# EasyEDA schematic SCH_ESP32-HMI.json

## Sheets
1 Sheet_1: TITLE: ESP32-HMI; REV: 1.0; Date: 2022-04-22; Sheet: 1/1; Drawn By: Link-Stardust; Company: SoTWild
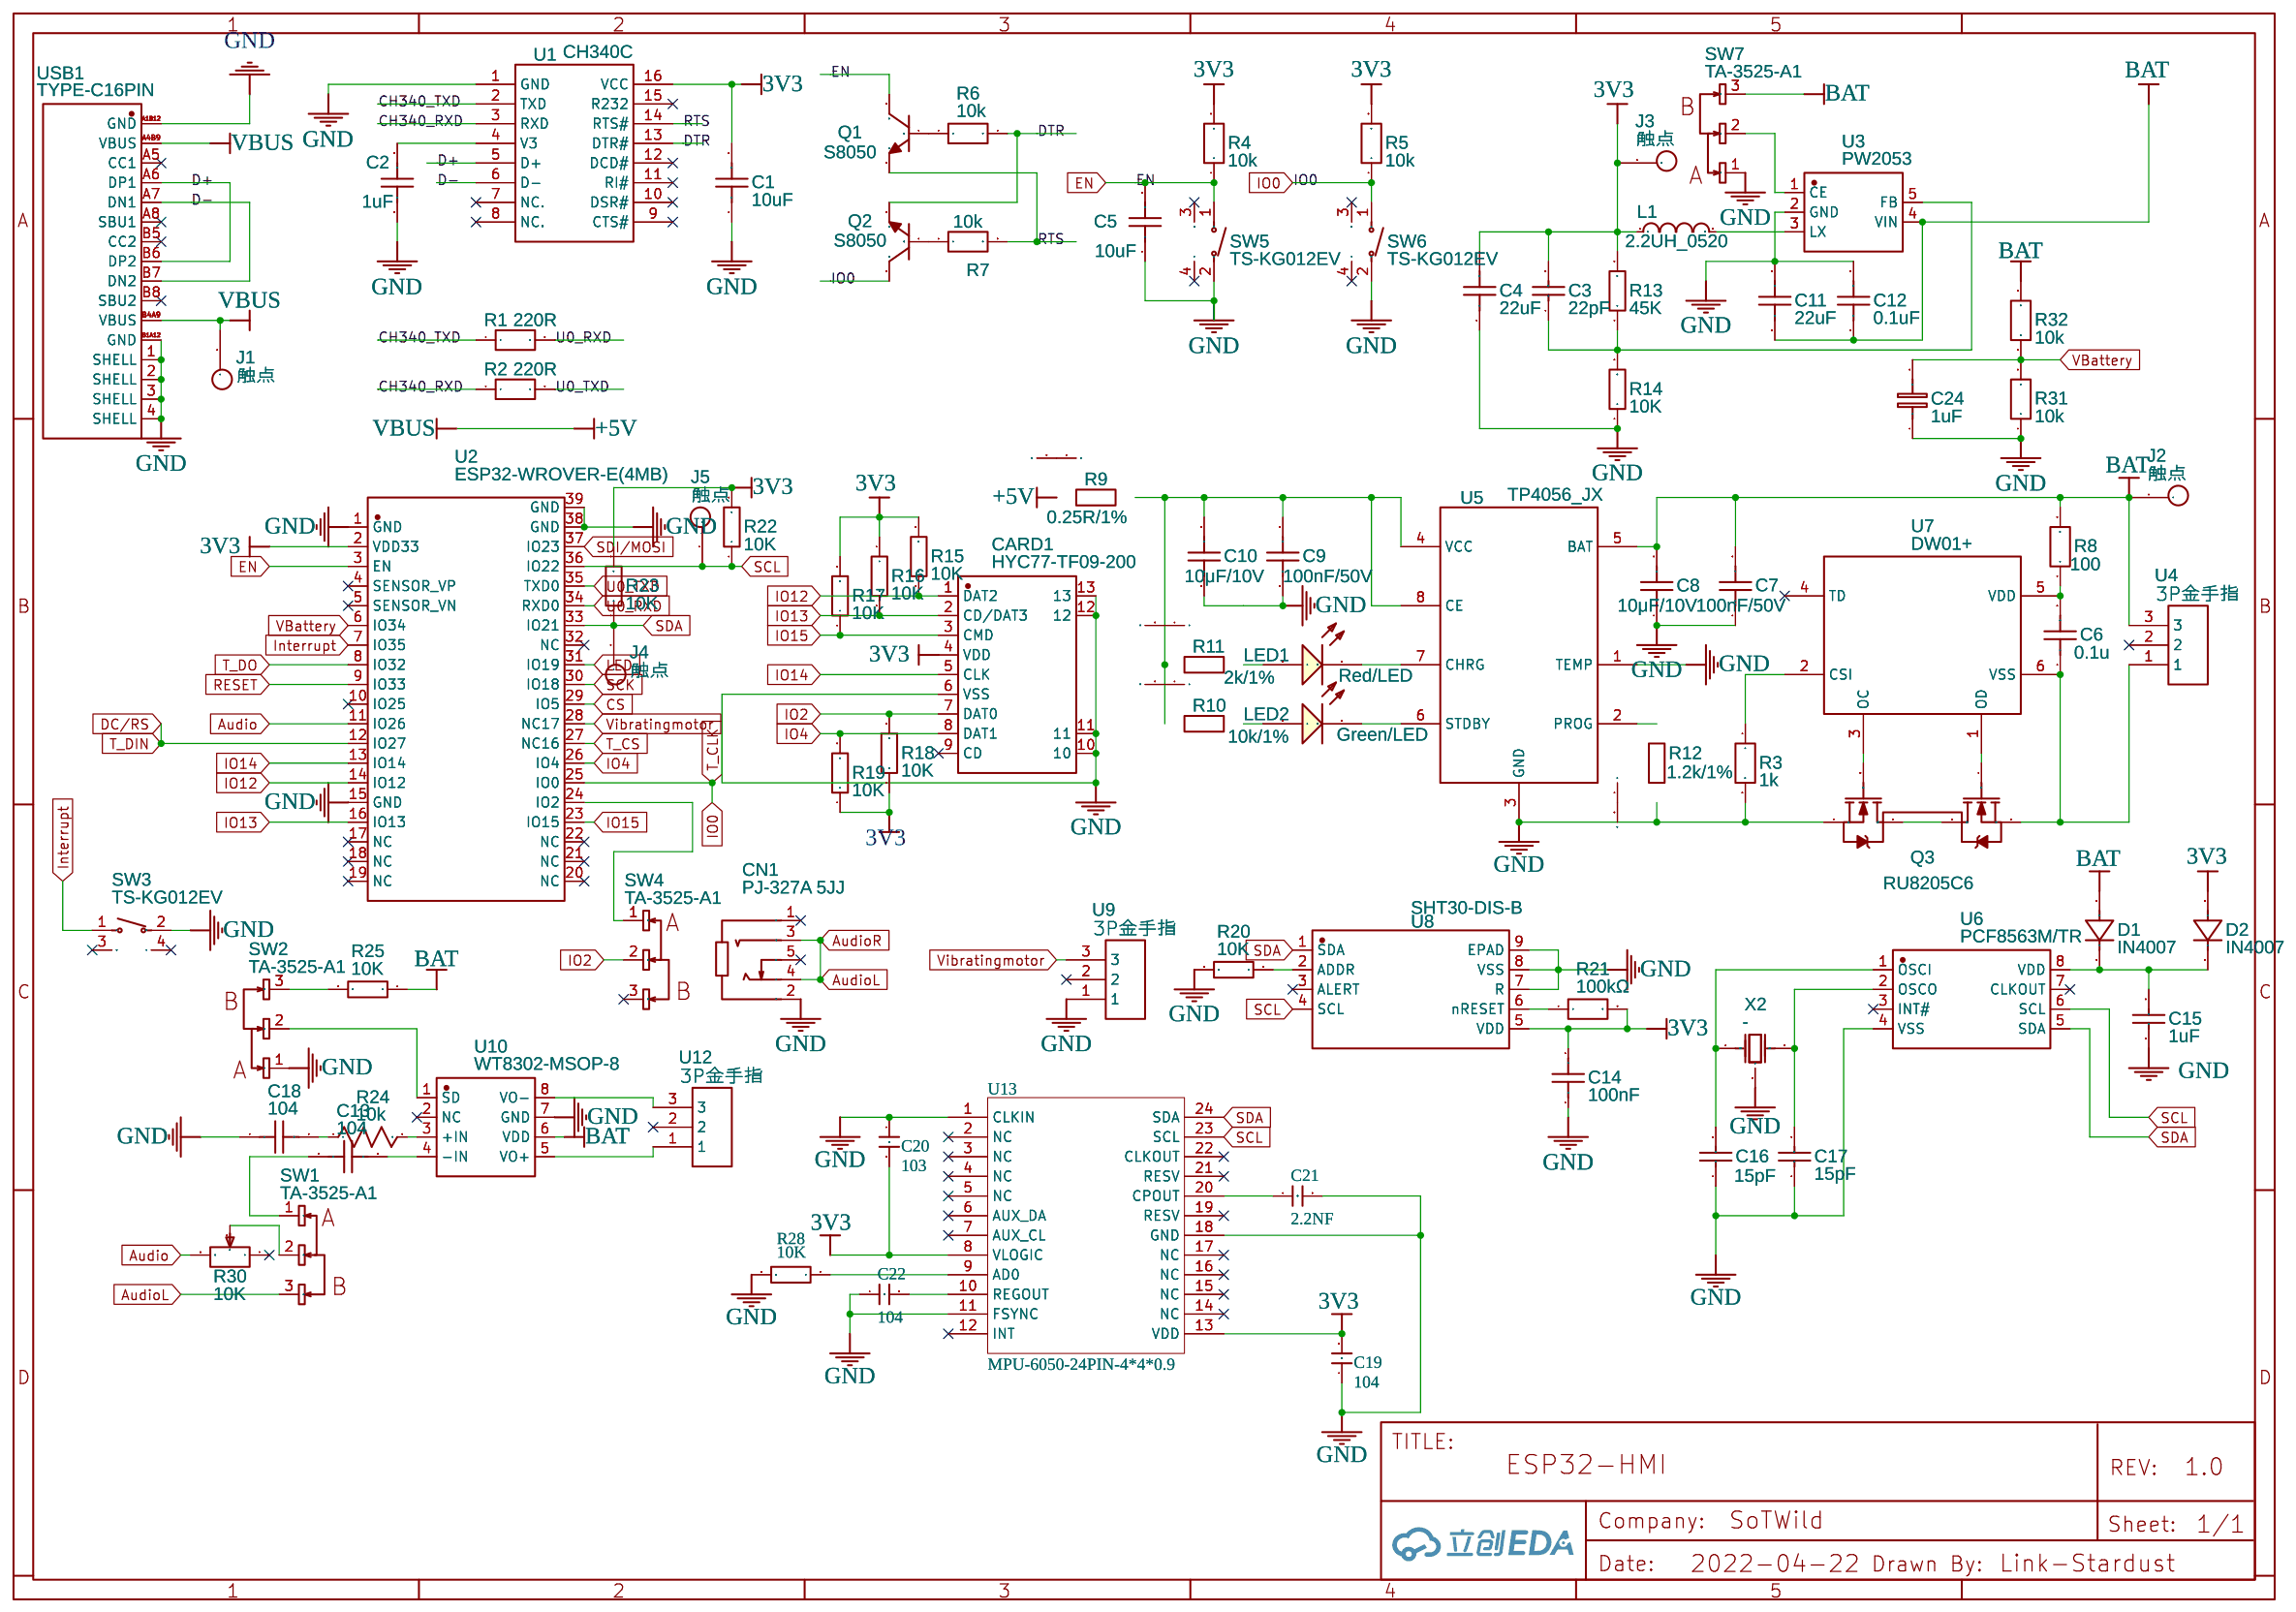
[diagram p0: Sheet_1]
2 Sheet_2: TITLE: Sheet_2; Date: 2022-07-26; Company: Your Company
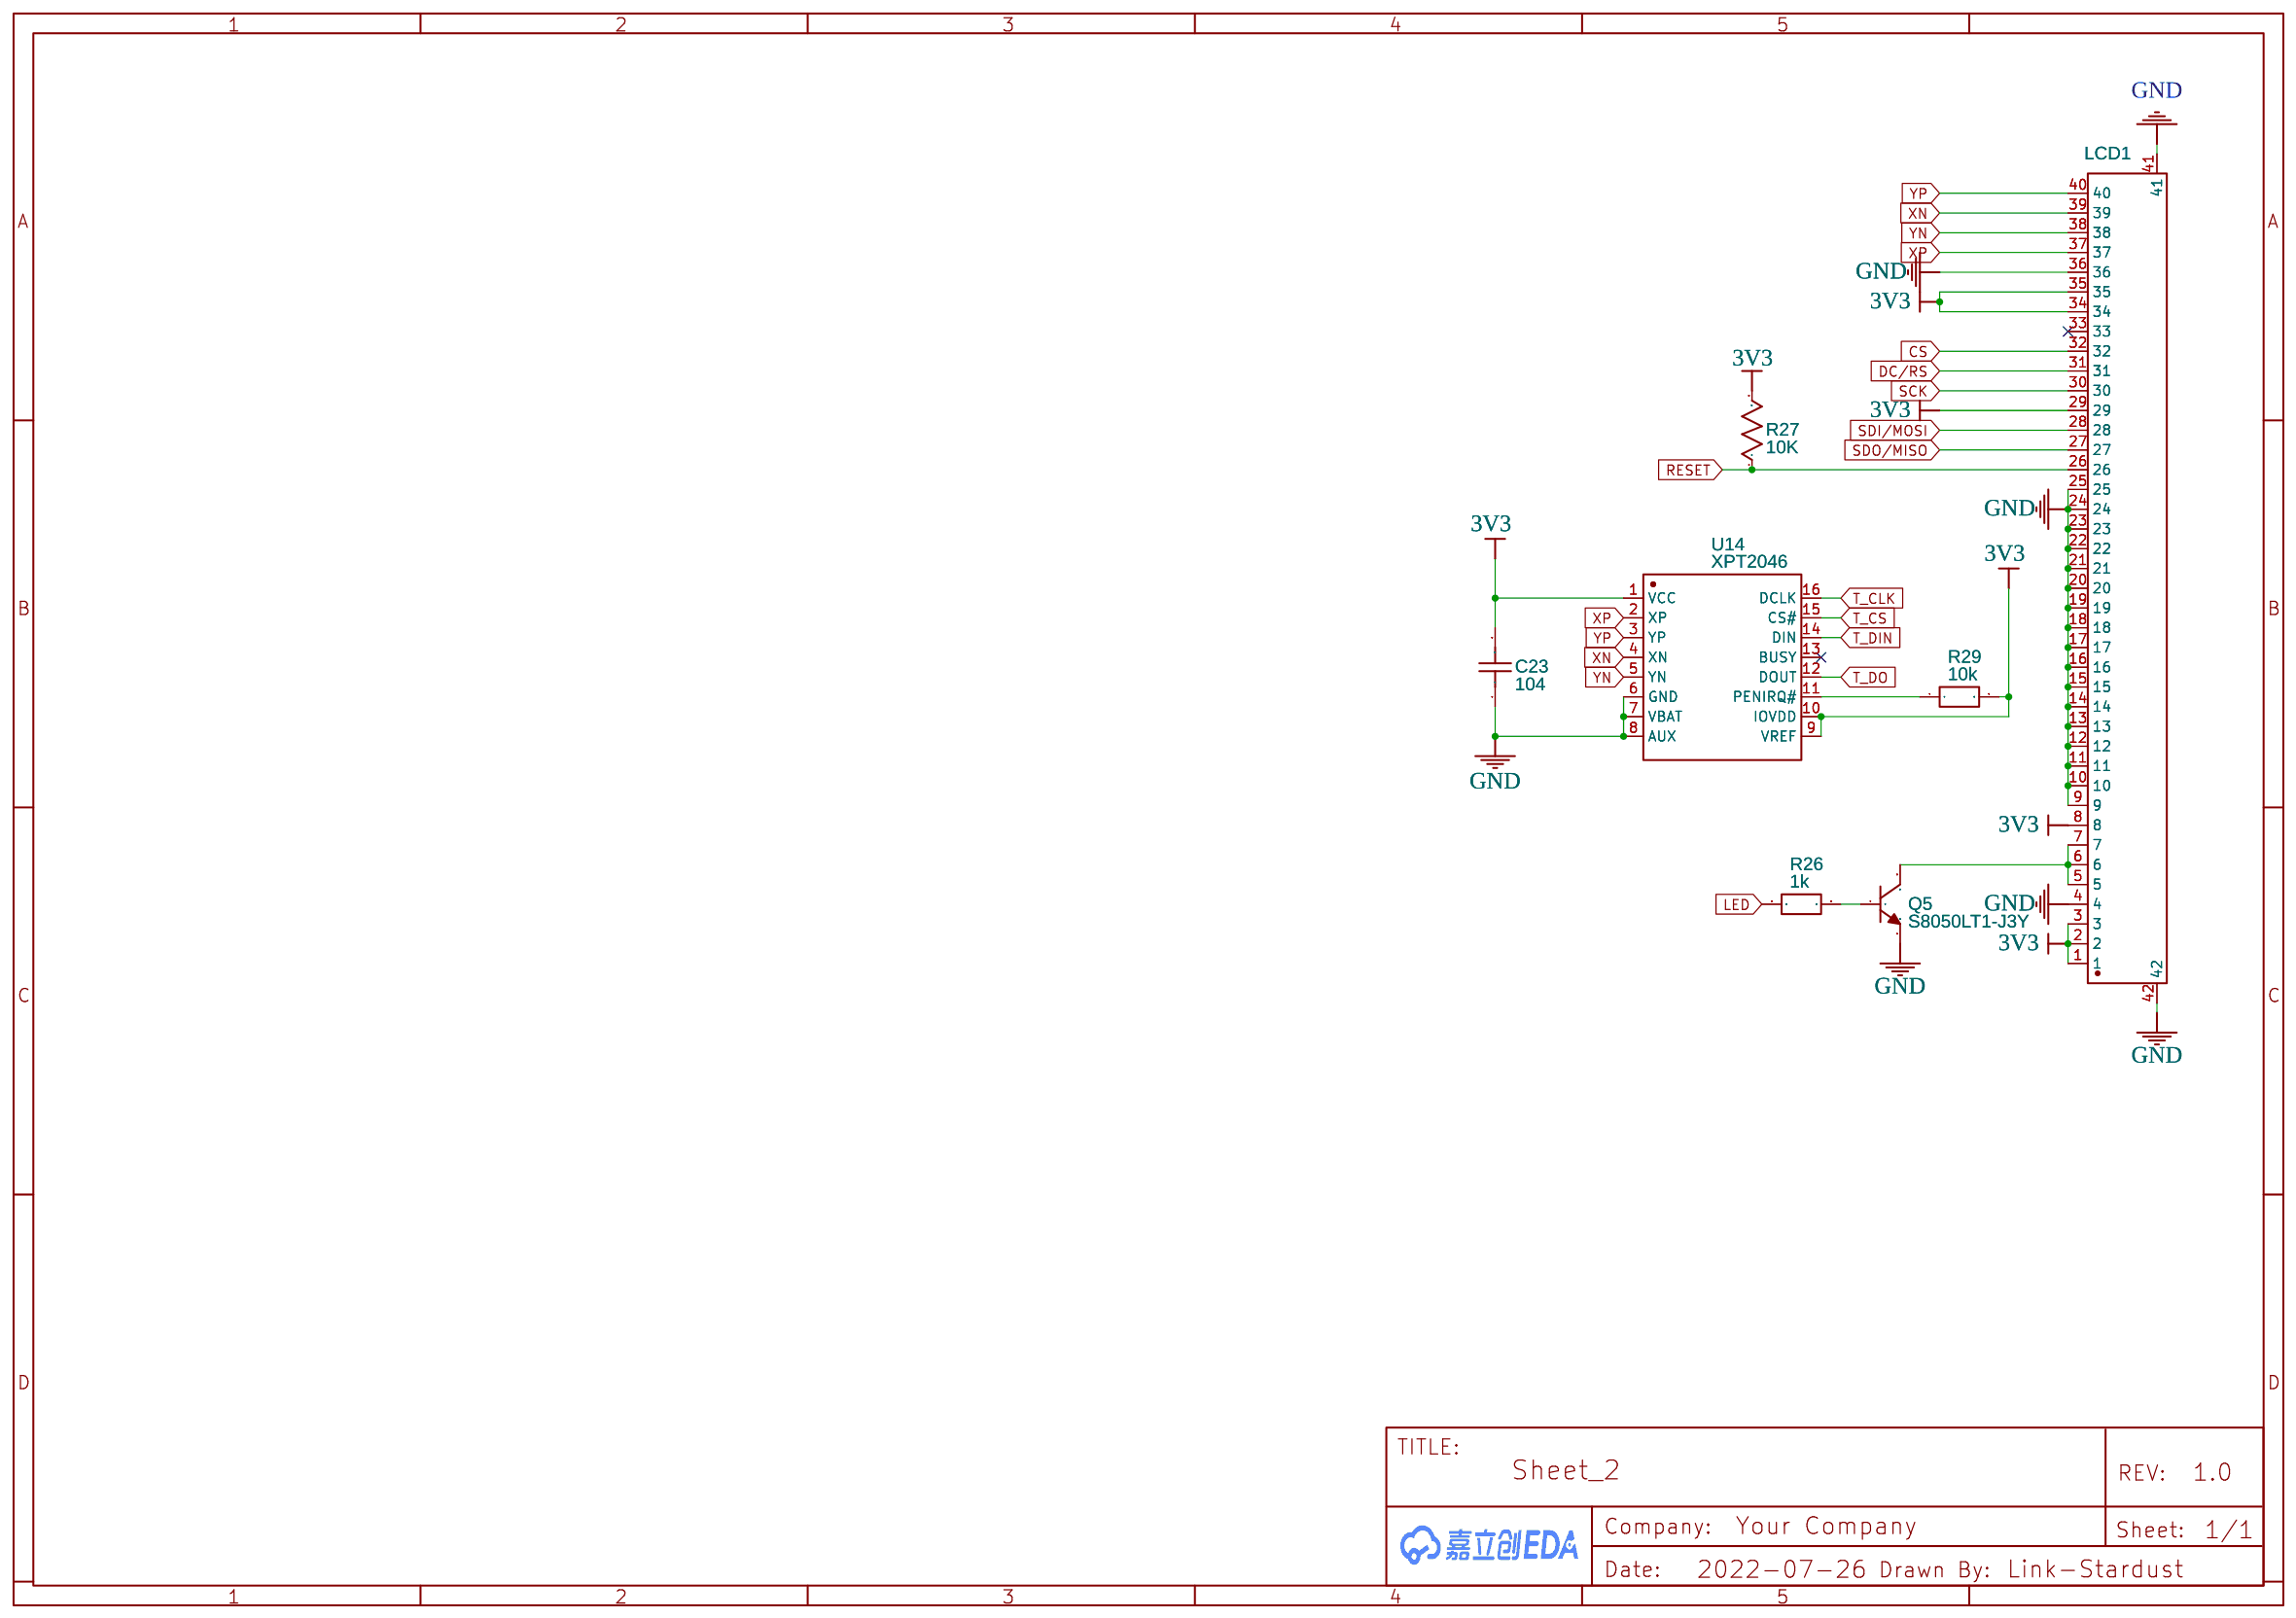
[diagram p1: Sheet_2]

## Parts
sheet Sheet_1
C1  10uF  [C0603]
C2  1uF  [C0603]
C3  22pF  [C0603]
C4  22uF  [C0805]
C5  10uF  [C0603]
C6  0.1u  [1206]
C7  100nF/50V  [0603_C_JX]
C8  10μF/10V  [0805_C_JX]
C9  100nF/50V  [0603_C_JX]
C10  10μF/10V  [0805_C_JX]
C11  22uF  [C0805]
C12  0.1uF  [C0603]
C13  104  [C0805]
C14  100nF  [0603]
C15  1uF  [C0603]
C16  15pF  [C0603]
C17  15pF  [C0603]
C18  104  [C0805]
C19  104  [C 0603]
C20  103  [C 0603]
C21  2.2NF  [C 0603]
C22  104  [C 0603]
C24  1uF  [C0603]
CARD1  HYC77-TF09-200  [TF-SMD_HYC77-TF09-200]
CN1  PJ-327A 5JJ  [AUDIO-SMD_PJ-327A5JJ]
D1  IN4007  [SMA_L4.3-W2.6-LS5.1-RD]
D2  IN4007  [SMA_L4.3-W2.6-LS5.1-RD]
J1  触点  [触点]
J2  触点  [触点]
J3  触点  [触点]
J4  触点  [触点]
J5  触点  [触点]
L1  2.2UH_0520  [IND-SMD_L2.5-W2.0]
LED1  Red/LED  [0603_D_JX]
LED2  Green/LED  [0603_D_JX]
Q1  S8050  [SOT-23-3_L2.9-W1.3-P1.90-LS2.4-BR]
Q2  S8050  [SOT-23-3_L2.9-W1.3-P1.90-LS2.4-BR]
Q3  RU8205C6  [SOT-23-6]
R1  220R  [R0603]
R2  220R  [R0603]
R3  1k  [0805]
R4  10k  [R0603]
R5  10k  [R0603]
R6  10k  [R0603]
R7  10k  [R0603]
R8  100  [0805]
R9  0.25R/1%  [1206_R_JX]
R10  10k/1%  [0603_R_JX]
R11  2k/1%  [0603_R_JX]
R12  1.2k/1%  [0805-R]
R13  45K  [R0603]
R14  10K  [R0603]
R15  10K  [R0603]
R16  10K  [R0603]
R17  10K  [R0603]
R18  10K  [R0603]
R19  10K  [R0603]
R20  10K  [R0402]
R21  100kΩ  [R0603]
R22  10K  [R0402]
R23  10K  [R0402]
R24  10k  [R0805]
R25  10K  [R0603]
R28  10K  [R 0603]
R30  10K  [RES-ADJ-TH_R1001B]
R31  10k  [R0603]
R32  10k  [R0603]
SW1  TA-3525-A1  [SW-SMD_3P-L9.1-W3.5-P2.50-EH6.8]
SW2  TA-3525-A1  [SW-SMD_3P-L9.1-W3.5-P2.50-EH6.8]
SW3  TS-KG012EV  [SW-SMD_TS-KG012EV]
SW4  TA-3525-A1  [SW-SMD_3P-L9.1-W3.5-P2.50-EH6.8]
SW5  TS-KG012EV  [SW-SMD_TS-KG012EV]
SW6  TS-KG012EV  [SW-SMD_TS-KG012EV]
SW7  TA-3525-A1  [SW-SMD_3P-L9.1-W3.5-P2.50-EH6.8]
U1  CH340C  [SOP-16_L10.0-W3.9-P1.27-LS6.0-BL]
U2  ESP32-WROVER-E(4MB)  [WIFIM-SMD_39P-L31.4-W18.0-P1.27]
U3  PW2053  [SOT-23-5_L2.9-W1.6-P0.95-LS2.8-BL]
U4  3P金手指  [3P金手指]
U5  TP4056_JX  [SOP8_150MIL_JX]
U6  PCF8563M/TR  [SOP-8_L4.9-W3.9-P1.27-LS6.0-BL]
U7  DW01+  [SOT-23-6-L]
U8  SHT30-DIS-B  [DFN-8_L2.5-W2.5-P0.50-BL-EP]
U9  3P金手指  [3P金手指]
U10  WT8302-MSOP-8  [MSOP-8_L3.0-W3.0-P0.65-LS4.9-BL]
U12  3P金手指  [3P金手指]
U13  MPU-6050-24PIN-4*4*0.9  [QFN24]
USB1  TYPE-C16PIN  [USB-C-SMD_TYPE-C16PIN]
X2  -  [OSC-SMD_BD2.0-P2.54_TMXLI-206F32.768KHZ12.5PF20PPM]
sheet Sheet_2
C23  104  [C0603]
LCD1  AFC07-S40ECA-00  [FPC-SMD_P0.50-40P_LCS-SJ-H2.0]
Q5  S8050LT1-J3Y  [SOT-23_L2.9-W1.3-P1.90-LS2.4-BR]
R26  1k  [R0603]
R27  10K  [R0603]
R29  10k  [R0603]
U14  XPT2046  [TSSOP-16_L5.0-W4.4-P0.65-LS6.4-BL]

## Library data of the parts
C1 C5 C23 = C_0603_US: Contributor: LCEDA_Lib
C2 = C_0603_US: Supplier Part: C36577; Supplier: LCSC; Contributor: LCEDA_Lib; Manufacturer Part: 0603F105M250NT; Manufacturer: FH
C3 = 0603CG220J201NT: Supplier: LCSC; Manufacturer: FH; Supplier Part: C63681; JLCPCB Part Class: Extended Part
C4 C11 = 08053D226MAT2A: Supplier: LCSC; Supplier Part: C597349; Manufacturer: AVX; Contributor: LCSC; JLCPCB Part Class: Extended Part
C6 = Cap_1206_US: Manufacturer Part: ?
C7-C10 = Capacitor: Supplier: LCSC
C12 = 0603BB104K500NGT: Supplier: LCSC; Supplier Part: C2168571; Manufacturer: Knowles(楼氏); Contributor: LCSC; JLCPCB Part Class: Extended Part
C13 C18 = C_0805_US: Contributor: LCEDA_Lib
C14 = 100nF: Voltage: 25V; Tolerance: ±10%; Supplier Part: C1590; Supplier: LCSC; Manufacturer: SAMSUNG; Manufacturer Part: CL10B104KA8NNNC
C15 = 0603B105K250NT: Supplier: LCSC; Manufacturer: FH; Supplier Part: C59302; JLCPCB Part Class: Extended Part
C16 C17 = 0603CG150J201NT: Supplier: LCSC; Manufacturer: FH; Supplier Part: C63677; JLCPCB Part Class: Extended Part
C19-C22 = -: BOM名称: 无极性贴片电容; 版权归属: 源创客; 学习资源: www.ooocke.com
C24 = Cap_0603_EU: Manufacturer Part: 0603F105M160NT; Supplier Part: C1689; Manufacturer: FH; Supplier: LCSC
CARD1 = HYC77-TF09-200: Supplier: LCSC; Supplier Part: C341092; Manufacturer: 华宇创; Contributor: LCSC; JLCPCB Part Class: Extended Part
CN1 = PJ-327A 5JJ: Supplier: LCSC; Supplier Part: C668605; Manufacturer: SHOU HAN; Contributor: LCSC; JLCPCB Part Class: Extended Part
D1 D2 = IN4007: Supplier: LCSC; Supplier Part: C9900004719; JLCPCB Part Class: Extended Part; Contributor: LCSC
J1-J5 = 触点: Contributor: TJBear
L1 = 2.2UH_0520: Supplier: LCSC; Supplier Part: C9900011665; Manufacturer: null; Manufacturer Part: 2.2uH_0520; Contributor: LCSC; JLCPCB Part Class: Extended Part
LED1 LED2 U5 = -: Supplier: LCSC
Q1 Q2 = S8050: Supplier: LCSC; Supplier Part: C2688231; Manufacturer: WPMtek(维攀微); Contributor: LCSC
Q3 = -: Supplier: LCSC; Manufacturer: Ruichips; Supplier Part: C94488; LCSC Assembly: Yes; SMT Type: Extend
R1 R2 R4-R7 R26 R29 = R_0603_EU: Contributor: LCEDA_Lib
R3 R8 = Res_0805(1/8W)_EU: Manufacturer Part: ?; Package Display: No; Mounted: Yes
R9 = Resistor: Supplier: LCSC; Package Display: No
R10 = Resistor: Supplier: LCSC; Package Display: No; Mounted: Yes
R11 R12 = Resistor: Supplier: LCSC; Mounted: Yes; Package Display: No
R13 = AC0603FR-0745K3L: Supplier: LCSC; Supplier Part: C227910; Manufacturer: YAGEO; Contributor: LCSC; JLCPCB Part Class: Extended Part; Resistance: 45.3kΩ
R14-R19 R25 = AC0603FR-0710KL: Supplier: LCSC; Manufacturer: YAGEO; Supplier Part: C116677; JLCPCB Part Class: Extended Part; Resistance: 10kΩ
R20 R22 R23 = RC0402JR-0710KL: Supplier: LCSC; Manufacturer: YAGEO; Supplier Part: C60489; JLCPCB Part Class: Extended Part
R21 = CR-03JL7--100K: Supplier: LCSC; Supplier Part: C217279; Manufacturer: Viking Tech; Resistance (Ohms): 100K; Contributor: LCSC; JLCPCB Part Class: Extended Part
R24 = R_0805_US: Contributor: LCEDA_Lib
R28 = -: BOM名称: 贴片电阻; 学习资源: www.ooocke.com; 版权归属: 源创客
R30 = R1001-B503-3P 14mm: Supplier: LCSC; Manufacturer: ReliaPro; Supplier Part: C10528
R31 R32 = R_0201_EU: Supplier Part: C81087; Supplier: LCSC; Contributor: LCEDA_Lib; Manufacturer Part: LE03WAJ0103T5E; Manufacturer: UniOhm
SW1 SW2 SW4 SW7 = TA-3525-A1: Supplier: LCSC; Supplier Part: C514018; Manufacturer: Yuandi; Contributor: LCSC; JLCPCB Part Class: Extended Part
SW3 SW5 SW6 = TS-KG012EV: Supplier: LCSC; Supplier Part: C410363; Manufacturer: Hanbo Electronic; Contributor: LCSC; JLCPCB Part Class: Extended Part
U1 = CH340C: Supplier: LCSC; Manufacturer: WCH; Supplier Part: C84681; Paste Type: recommend
U2 = ESP32-WROVER-E(16MB): Supplier: LCSC; Supplier Part: C529589; Manufacturer: Espressif Systems; Contributor: LCSC; JLCPCB Part Class: Extended Part
U3 = PW2053: Supplier: LCSC; Supplier Part: C9900013179; Manufacturer: null; JLCPCB Part Class: Extended Part; Contributor: lcsc
U4 U9 U12 = 3P金手指: Contributor: Felix_yy
U6 = PCF8563M/TR: Supplier: LCSC; Supplier Part: C434478; Manufacturer: HGSEMI; Contributor: LCSC; JLCPCB Part Class: Extended Part
U7 = -: Manufacturer Part: ?; Contributor: lianxi117; Package Display: No
U8 = SHT30-DIS-B: Supplier: LCSC; Manufacturer: Sensirion; Supplier Part: C77361; JLCPCB Part Class: Extended Part
U10 = WT8302-MSOP-8: Supplier: LCSC; Supplier Part: C9900017285; Manufacturer: null; Contributor: lcsc; JLCPCB Part Class: Extended Part
USB1 = TYPE-C16PIN: Supplier: LCSC; Supplier Part: C393939; Manufacturer: SHOU HAN; Contributor: LCSC
X2 = TMXLI-206F32.768KHZ12PF10PPM: Supplier: LCSC; Supplier Part: C164061; Manufacturer: Zhejiang Abel Elec; Manufacturer Part: TMXLi-206F32.768KHZ12PF10PPM; Contributor: LCSC; JLCPCB Part Class: Extended Part
LCD1 = AFC07-S40ECA-00: Supplier: LCSC; Supplier Part: C262648; Manufacturer: JUSHUO; Contributor: LCSC
Q5 = S8050LT1-J3Y: Supplier: LCSC; Supplier Part: C2962087; Manufacturer: FH(风华); link: https://atta.szlcsc.com/upload/public/pdf/source/20220411/740B3F4857AB400E9826209E74F1EDA4.pdf; Contributor: lcsc; JLCPCB Part Class: Extended Part
R27 = R_0603_US: Contributor: LCEDA_Lib
U14 = XPT2046: Supplier: LCSC; Manufacturer: XPT; Supplier Part: C19076; JLCPCB Part Class: Extended Part

## Nets
3V3: C1.2 C3.2 C4.2 C14.2 C19.2 C20.2 C23.2 CARD1.4(VDD) D2.2(A) J3.1 L1.1 LCD1.1 LCD1.2 LCD1.3 LCD1.8 LCD1.29 LCD1.34 LCD1.35 R4.2 R5.2 R13.2 R15.2 R16.1 R17.2 R18.1 R19.1 R21.2 R22.2 R23.2 R27.2 R29.2 U1.16(VCC) U2.2(VDD33) U8.5(VDD) U13.8(VLOGIC) U13.13(VDD) U14.1(VCC) U14.9(VREF) U14.10(IOVDD)
+5V: J1.1 R9.1 USB1.A4B9(VBUS) USB1.B4A9(VBUS)
GND: C1.1 C2.1 C4.1 C5.1 C7.1 C8.1 C9.1 C10.1 C11.1 C12.2 C14.1 C15.1 C16.1 C17.1 C18.1 C19.1 C20.1 C21.2 C22.1 C23.1 C24.1 CARD1.6(VSS) CARD1.10 CARD1.11 CARD1.12 CARD1.13 CN1.2 LCD1.4 LCD1.9 LCD1.10 LCD1.11 LCD1.12 LCD1.13 LCD1.14 LCD1.15 LCD1.16 LCD1.17 LCD1.18 LCD1.19 LCD1.20 LCD1.21 LCD1.22 LCD1.23 LCD1.24 LCD1.25 LCD1.36 LCD1.41 LCD1.42 Q3.1(S1) Q5.2 R3.2 R12.1 R14.1 R20.2 R28.2 R31.1 SW2.1 SW3.2 SW5.2 SW6.2 SW7.1 U1.1(GND) U2.1(GND) U2.15(GND) U2.38(GND) U2.39(GND) U3.2(GND) U5.1(TEMP) U5.3(GND) U6.4(VSS) U8.7(R) U8.8(VSS) U8.9(EPAD) U9.1 U10.7(GND) U13.1(CLKIN) U13.11(FSYNC) U13.18(GND) U14.6(GND) U14.7(VBAT) U14.8(AUX) USB1.1(SHELL) USB1.2(SHELL) USB1.3(SHELL) USB1.4(SHELL) USB1.A1B12(GND) USB1.B1A12(GND) X2.3
VBattery: C24.2 R31.2 R32.1 U2.6(IO34)
Audio: R30.3 U2.11(IO26)
AudioL: CN1.3 CN1.4 SW1.3
BAT: C7.2 C8.2 C11.2 C12.1 D1.2(A) J2.1 R8.2 R25.1 R32.2 SW7.3 U3.4(VIN) U4.3 U5.5(BAT) U10.6(VDD)
CH340_RXD: R2.1 U1.3(RXD)
CH340_TXD: R1.1 U1.2(TXD)
CS: LCD1.32 U2.29(IO5)
D+: U1.5(D+) USB1.A6(DP1) USB1.B6(DP2)
D-: U1.6(D-) USB1.A7(DN1) USB1.B7(DN2)
DC/RS: LCD1.31 U2.12(IO27) U14.14(DIN)
DTR: Q2.2(E) R6.2 U1.13(DTR#)
EN: C5.2 Q1.3(C) R4.1 SW5.1 U2.3(EN)
Interrupt: SW3.1 U2.7(IO35)
IO0: Q2.3(C) R5.1 SW6.1 U2.25(IO0) U14.16(DCLK)
IO2: CARD1.7(DAT0) R18.2 SW4.2
IO4: CARD1.8(DAT1) R19.2 U2.26(IO4)
IO12: CARD1.1(DAT2) R15.1 U2.14(IO12)
IO13: CARD1.2(CD/DAT3) R16.2 U2.16(IO13)
IO14: CARD1.5(CLK) U2.13(IO14)
IO15: CARD1.3(CMD) R17.1 U2.23(IO15)
LED: R26.1 U2.31(IO19)
RESET: LCD1.26 R27.1 U2.9(IO33)
RTS: Q1.2(E) R7.2 U1.14(RTS#)
SCK: LCD1.30 U2.30(IO18)
SCL: J5.1 R22.1 U2.36(IO22) U6.6(SCL) U8.4(SCL) U13.23(SCL)
SDA: J4.1 R23.1 U2.33(IO21) U6.5(SDA) U8.1(SDA) U13.24(SDA)
SDI/MOSI: LCD1.28 U2.37(IO23)
SDO/MISO: LCD1.27
T_CS: U2.27(NC16) U14.15(CS#)
T_DO: U2.8(IO32) U14.12(DOUT)
U0_RXD: R1.2 U2.34(RXD0)
U0_TXD: R2.2 U2.35(TXD0)
Vibratingmotor: U2.28(NC17) U9.3
XN: LCD1.39 U14.4(XN)
XP: LCD1.37 U14.2(XP)
YN: LCD1.38 U14.5(YN)
YP: LCD1.40 U14.3(YP)
Net-(C2-2): C2.2 U1.4(V3)
Net-(C3-1): C3.1 R13.1 R14.2 U3.5(FB)
Net-(C6-1): C6.1 Q3.3(S2) U4.1 U7.6(VSS)
Net-(C6-2): C6.2 R8.1 U7.5(VDD)
Net-(C9-2): C9.2 C10.2 R9.2 R10.1 R11.1 U5.4(VCC) U5.8(CE)
Net-(C13-1): C13.1 SW1.1
Net-(C13-2): C13.2 U10.4(-IN)
Net-(C15-2): C15.2 D1.1(K) D2.1(K) U6.8(VDD)
Net-(C16-2): C16.2 U6.1(OSCI) X2.1(OSC1)
Net-(C17-2): C17.2 U6.2(OSCO) X2.2(OSC2)
Net-(C18-2): C18.2 R24.1
Net-(C21-1): C21.1 U13.20(CPOUT)
Net-(C22-2): C22.2 U13.10(REGOUT)
Net-(L1-2): L1.2 U3.3(LX)
Net-(LCD1-5): LCD1.5 LCD1.6 LCD1.7 Q5.3
Net-(LED1-1): LED1.1(A) R11.2
Net-(LED1-2): LED1.2(C) U5.7(CHRG)
Net-(LED2-1): LED2.1(A) R10.2
Net-(LED2-2): LED2.2(C) U5.6(STDBY)
Net-(Q1-1): Q1.1(B) R6.1
Net-(Q2-1): Q2.1(B) R7.1
Net-(Q3-2): Q3.2(D1/D2) Q3.5(D1/D2)
Net-(Q3-4): Q3.4(G2) U7.1(OD)
Net-(Q3-6): Q3.6(G1) U7.3(OC)
Net-(Q5-1): Q5.1 R26.2
Net-(R3-1): R3.1 U7.2(CSI)
Net-(R12-2): R12.2 U5.2(PROG)
Net-(R20-1): R20.1 U8.2(ADDR)
Net-(R21-1): R21.1 U8.6(nRESET)
Net-(R24-2): R24.2 U10.3(+IN)
Net-(R25-2): R25.2 SW2.3
Net-(R28-1): R28.1 U13.9(AD0)
Net-(R29-1): R29.1 U14.11(PENIRQ#)
Net-(R30-2): R30.2 SW1.2
Net-(SW2-2): SW2.2 U10.1(SD)
Net-(SW4-1): SW4.1 U2.24(IO2)
Net-(SW7-2): SW7.2 U3.1(CE)
Net-(U10-5): U10.5(VO+) U12.1
Net-(U10-8): U10.8(VO-) U12.3

Not connected (* = marked no-connect by the designer): CARD1 9(CD)*; CN1 1* 5*; LCD1 33*; R30 1*; SW3 3* 4*; SW4 3*; SW5 3* 4*; SW6 3* 4*; U1 7(NC.)* 8(NC.)* 9(CTS#)* 10(DSR#)* 11(RI#)* 12(DCD#)* 15(R232)*; U2 4(SENSOR_VP)* 5(SENSOR_VN)* 10(IO25)* 17(NC)* 18(NC)* 19(NC)* 20(NC)* 21(NC)* 22(NC)* 32(NC)*; U4 2*; U6 3(INT#)* 7(CLKOUT)*; U7 4(TD)*; U8 3(ALERT)*; U9 2*; U10 2(NC)*; U12 2*; U13 2(NC)* 3(NC)* 4(NC)* 5(NC)* 6(AUX_DA)* 7(AUX_CL)* 12(INT)* 14(NC)* 15(NC)* 16(NC)* 17(NC)* 19(RESV)* 21(RESV)* 22(CLKOUT)*; U14 13(BUSY)*; USB1 A5(CC1)* A8(SBU1)* B5(CC2)* B8(SBU2)*
